# Altium schematic sheet ae302f.SchDoc
size C
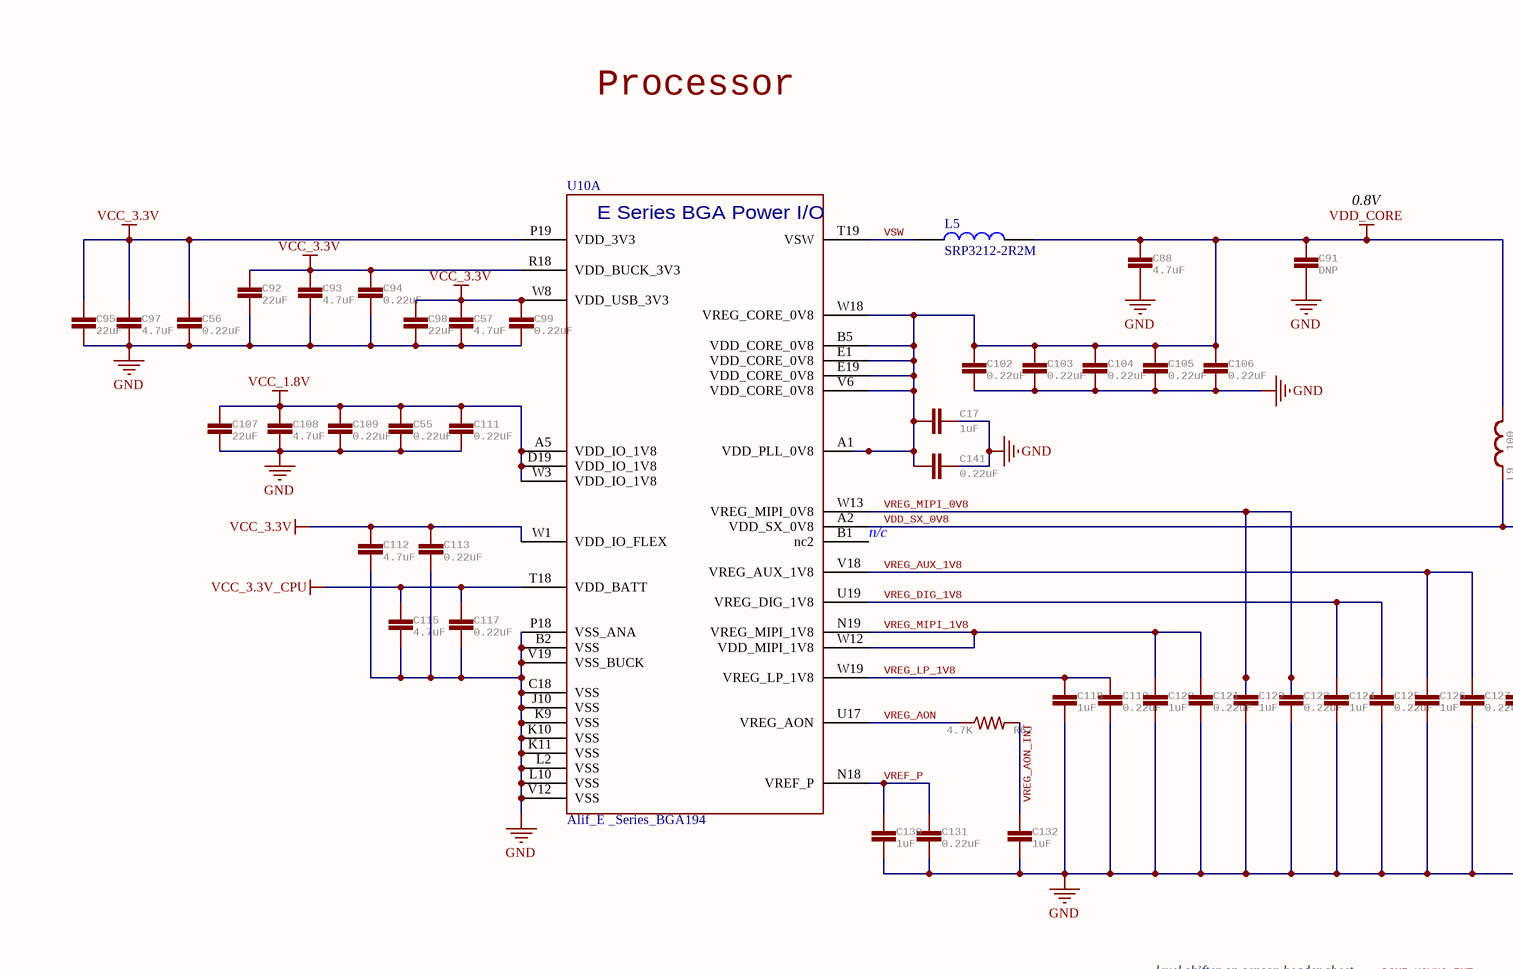
[diagram p0: ae302f.SchDoc, top left]
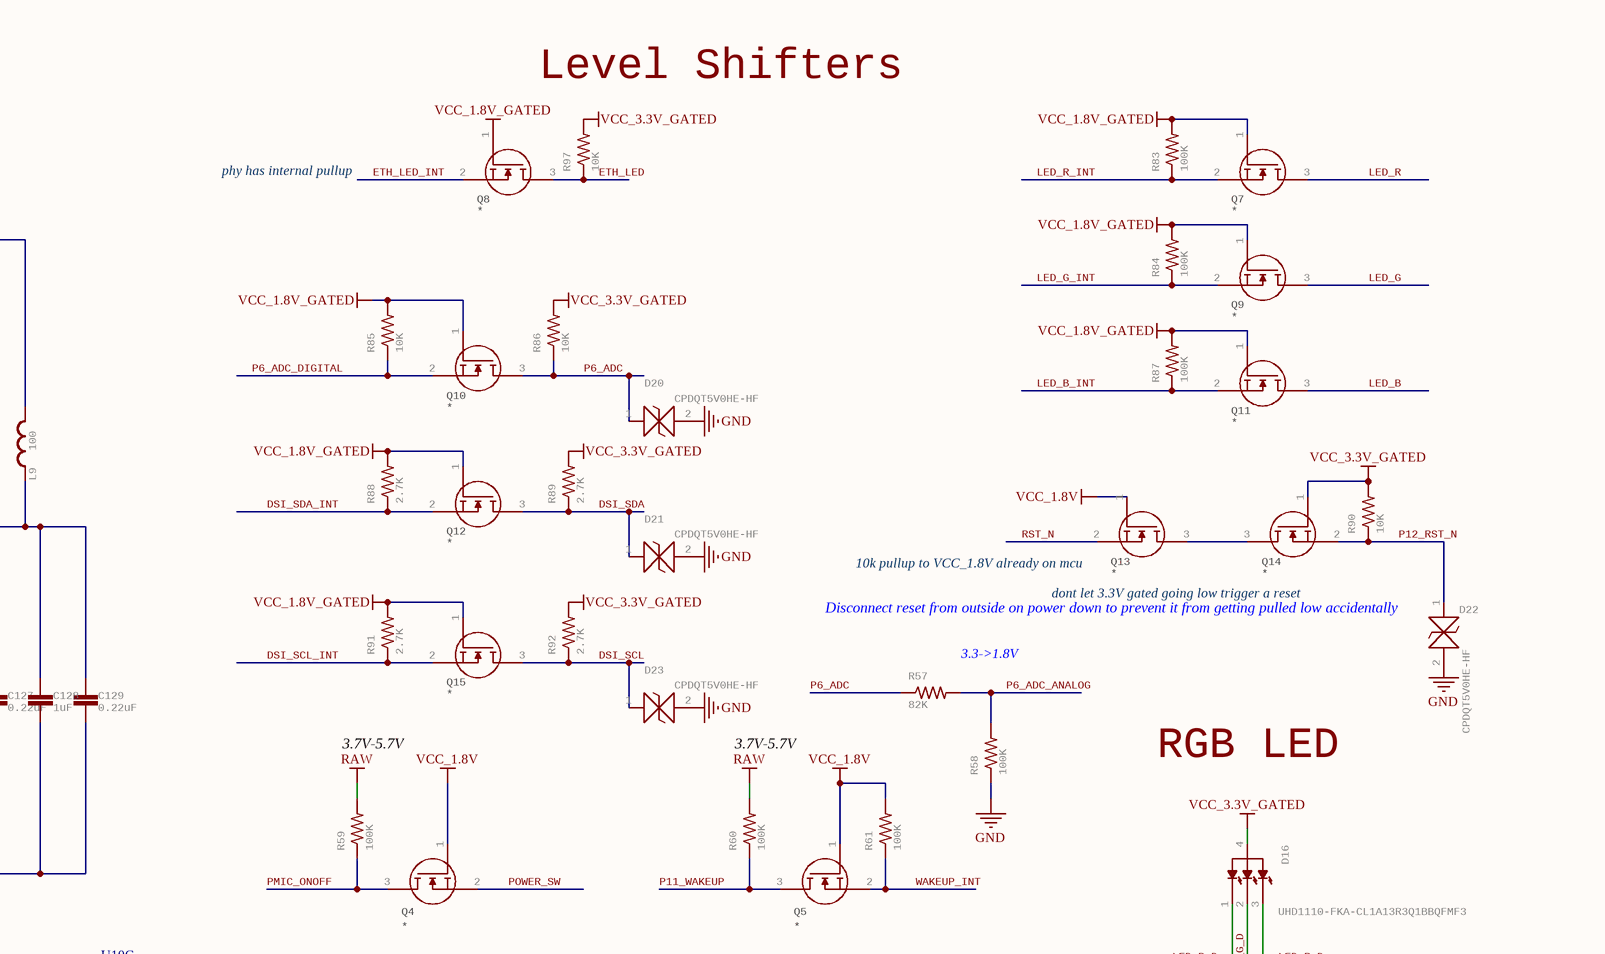
[diagram p1: ae302f.SchDoc, top right]
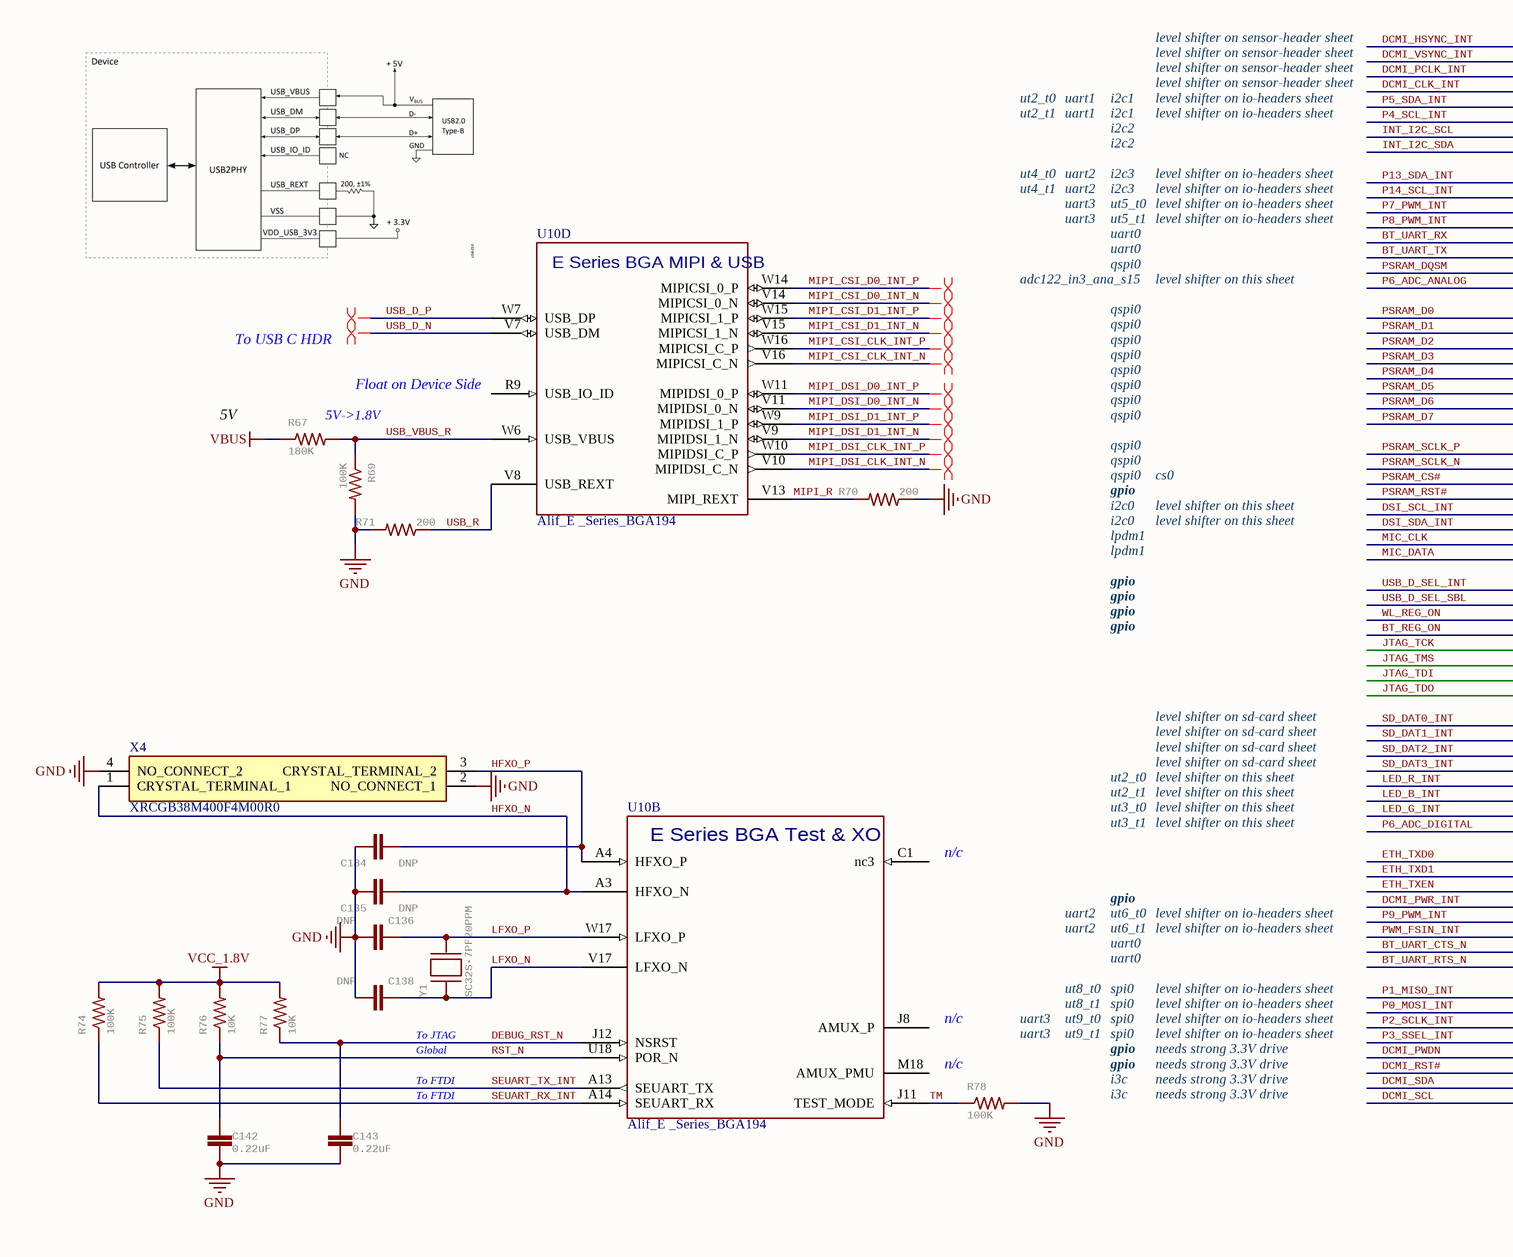
[diagram p2: ae302f.SchDoc, bottom left]
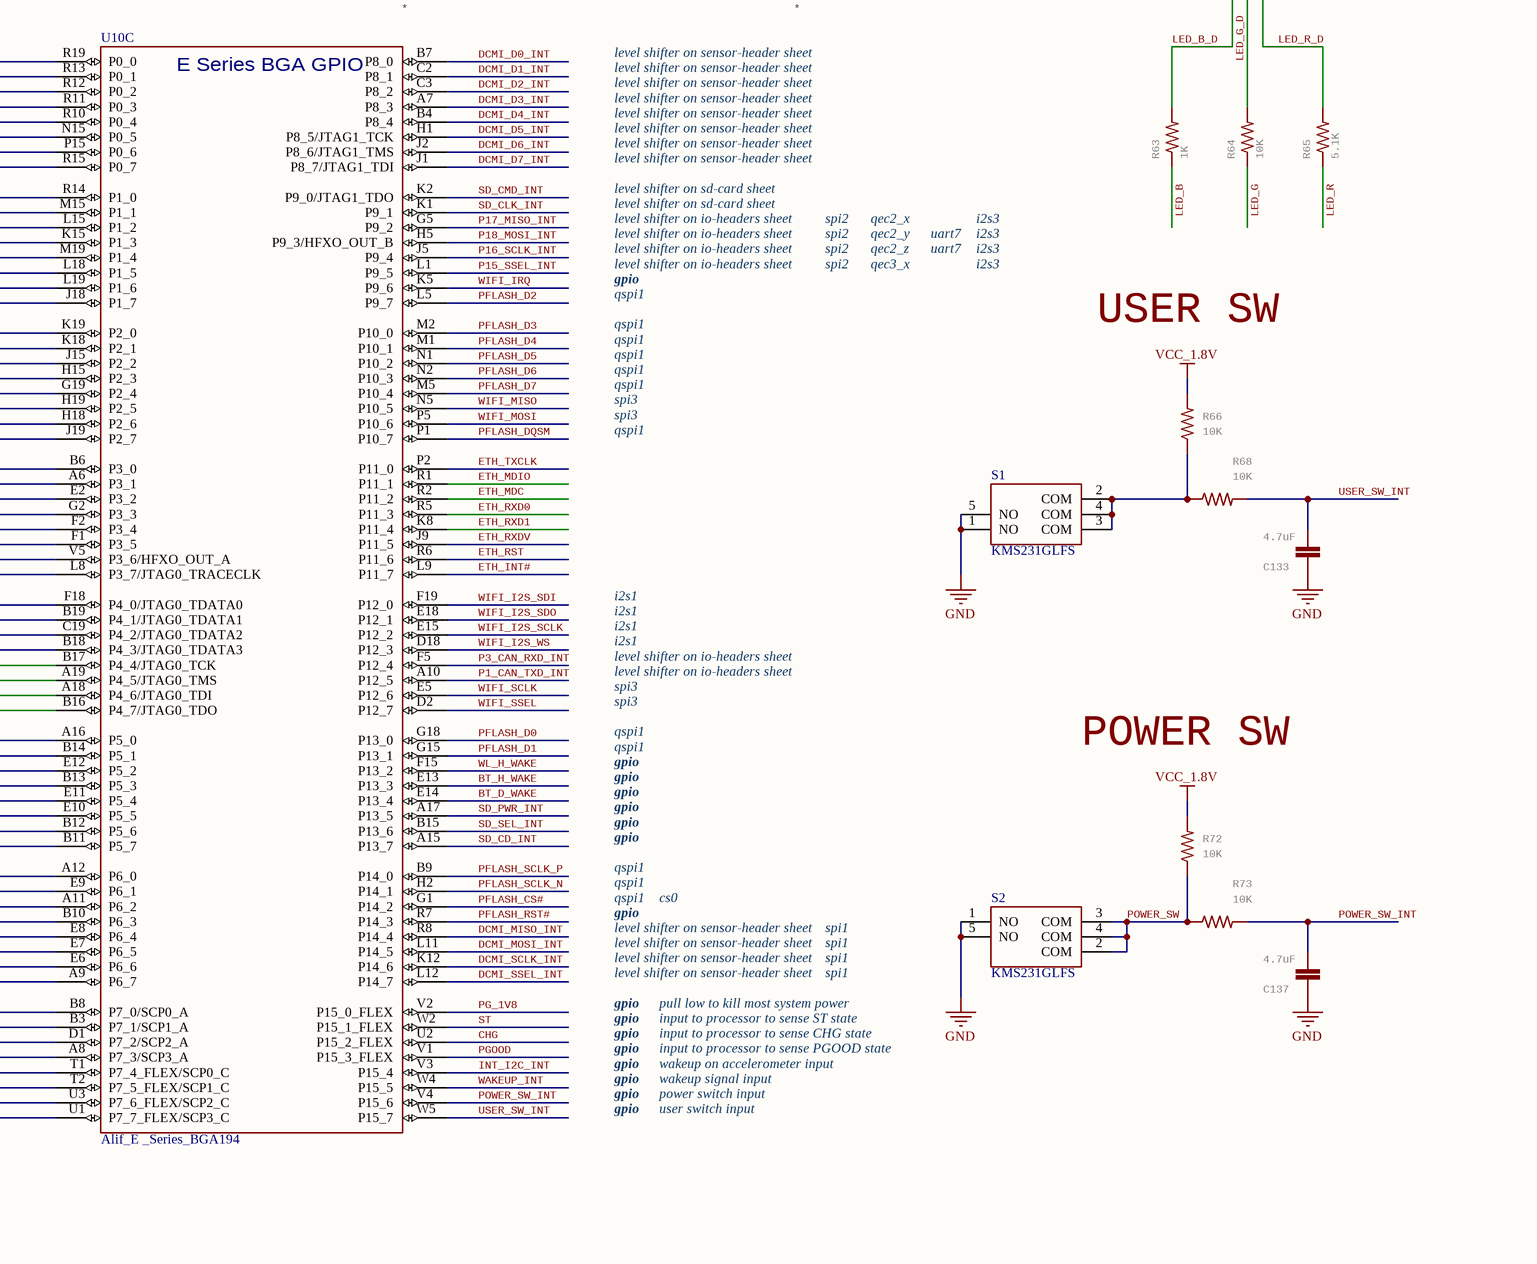
[diagram p3: ae302f.SchDoc, bottom right]

## Parts
C17  1uF  [0402-CAP]
C55  0.22uF  [C0201]
C56  0.22uF  [C0201]
C57  4.7uF  [0402-CAP]
C88  4.7uF  [0402-CAP]
C91  DNP  [0805]
C92  22uF  [0805]
C93  4.7uF  [0402-CAP]
C94  0.22uF  [C0201]
C95  22uF  [0805]
C97  4.7uF  [0402-CAP]
C98  22uF  [0805]
C99  0.22uF  [C0201]
C102  0.22uF  [C0201]
C103  0.22uF  [C0201]
C104  0.22uF  [C0201]
C105  0.22uF  [C0201]
C106  0.22uF  [C0201]
C107  22uF  [0805]
C108  4.7uF  [0402-CAP]
C109  0.22uF  [C0201]
C111  0.22uF  [C0201]
C112  4.7uF  [0402-CAP]
C113  0.22uF  [C0201]
C115  4.7uF  [0402-CAP]
C117  0.22uF  [C0201]
C118  1uF  [0402-CAP]
C119  0.22uF  [C0201]
C120  1uF  [0402-CAP]
C121  0.22uF  [C0201]
C122  1uF  [0402-CAP]
C123  0.22uF  [C0201]
C124  1uF  [0402-CAP]
C125  0.22uF  [C0201]
C126  1uF  [0402-CAP]
C127  0.22uF  [C0201]
C128  1uF  [0402-CAP]
C129  0.22uF  [C0201]
C130  1uF  [0402-CAP]
C131  0.22uF  [C0201]
C132  1uF  [0402-CAP]
C133  4.7uF  [0402-CAP]
C134  DNP  [C0201]
C135  DNP  [C0201]
C136  DNP  [C0201]
C137  4.7uF  [0402-CAP]
C138  DNP  [C0201]
C141  0.22uF  [C0201]
C142  0.22uF  [C0201]
C143  0.22uF  [C0201]
D16  UHD1110-FKA-CL1A13R3Q1BBQFMF3  [LED_UHD1110-FKA-CL1A13R3Q1BBQFMF3]
D20  CPDQT5V0HE-HF  [CPDQT5V0HEHF]
D21  CPDQT5V0HE-HF  [CPDQT5V0HEHF]
D22  CPDQT5V0HE-HF  [CPDQT5V0HEHF]
D23  CPDQT5V0HE-HF  [CPDQT5V0HEHF]
L5  SRP3212-2R2M  [IND3225X100N]
L9  100  [C0402]
Q4  NMOS  [DFN1006]  (value not drawn)
Q5  NMOS  [DFN1006]  (value not drawn)
Q7  NMOS  [DFN1006]  (value not drawn)
Q8  NMOS  [DFN1006]  (value not drawn)
Q9  NMOS  [DFN1006]  (value not drawn)
Q10  NMOS  [DFN1006]  (value not drawn)
Q11  NMOS  [DFN1006]  (value not drawn)
Q12  NMOS  [DFN1006]  (value not drawn)
Q13  NMOS  [DFN1006]  (value not drawn)
Q14  NMOS  [DFN1006]  (value not drawn)
Q15  NMOS  [DFN1006]  (value not drawn)
R57  82K  [R0201]
R58  100K  [R0201]
R59  100K  [0402-RES]
R60  100K  [R0201]
R61  100K  [R0201]
R62  4.7K  [0402-RES]
R63  1K  [R0201]
R64  10K  [R0201]
R65  5.1K  [R0201]
R66  10K  [0402-RES]
R67  180K  [R0201]
R68  10K  [0402-RES]
R69  100K  [R0201]
R70  200  [R0201]
R71  200  [R0201]
R72  10K  [0402-RES]
R73  10K  [0402-RES]
R74  100K  [R0201]
R75  100K  [R0201]
R76  10K  [R0201]
R77  10K  [R0201]
R78  100K  [r0201]
R83  100K  [R0201]
R84  100K  [R0201]
R85  10K  [R0201]
R86  10K  [R0201]
R87  100K  [R0201]
R88  2.7K  [R0201]
R89  2.7K  [R0201]
R90  10K  [R0201]
R91  2.7K  [R0201]
R92  2.7K  [R0201]
R97  10K  [R0201]
S1  KMS231GLFS  [KMS231GLFS]
S2  KMS231GLFS  [KMS231GLFS]
U10  Alif_E _Series_BGA194  [BGA194 _CENTERED]  (parts A,B,C,D of 4)
X4  XRCGB38M400F4M00R0  [XTAL_2016]
Y1  SC32S-7PF20PPM  [XTAL_ABS07-32.768KHZ-7-T]

## Nets
GND: C17.2 C55.1 C56.1 C57.2 C88.2 C91.1 C92.1 C93.2 C94.1 C95.1 C97.2 C98.1 C99.1 C102.1 C103.1 C104.1 C105.1 C106.1 C107.1 C108.2 C109.1 C111.1 C112.2 C113.1 C115.2 C117.1 C118.2 C119.1 C120.2 C121.1 C122.2 C123.1 C124.2 C125.1 C126.2 C127.2 C128.2 C129.1 C130.2 C131.1 C132.2 C133.1 C134.1 C135.1 C136.2 C137.1 C138.2 C141.1 C142.1 C143.1 D20.2 D21.2 D22.2 D23.2 R58.1 R69.2 R70.1 R71.2 R78.2 S1.1(NO) S1.5(NO) S2.1(NO) S2.5(NO) U10.B2(VSS) U10.C18(VSS) U10.J10(VSS) U10.K9(VSS) U10.K10(VSS) U10.K11(VSS) U10.L2(VSS) U10.L10(VSS) U10.P18(VSS_ANA) U10.V12(VSS) U10.V19(VSS_BUCK) X4.2(NO_CONNECT_1) X4.4(NO_CONNECT_2)
RAW: R59.2 R60.2
VBUS: R67.1
VCC_1.8V: C55.2 C107.2 C108.1 C109.2 C111.2 Q4.1(G) Q5.1(G) Q13.1(G) R61.2 R66.2 R72.2 R74.2 R75.2 R76.2 R77.2 U10.A5(VDD_IO_1V8) U10.D19(VDD_IO_1V8) U10.W3(VDD_IO_1V8)
VCC_1.8V_GATED: Q7.1(G) Q8.1(G) Q9.1(G) Q10.1(G) Q11.1(G) Q12.1(G) Q15.1(G) R83.2 R84.2 R85.2 R87.2 R88.2 R91.2
VCC_3.3V: C56.2 C57.1 C92.2 C93.1 C94.2 C95.2 C97.1 C98.2 C99.2 C112.1 C113.2 U10.P19(VDD_3V3) U10.R18(VDD_BUCK_3V3) U10.W1(VDD_IO_FLEX) U10.W8(VDD_USB_3V3)
VCC_3.3V_CPU: C115.1 C117.2 U10.T18(VDD_BATT)
VCC_3.3V_GATED: D16.4(ANODE) Q14.1(G) R86.2 R89.2 R90.2 R92.2 R97.2
VDD_CORE: C17.1 C88.1 C91.2 C102.2 C103.2 C104.2 C105.2 C106.2 C141.2 L5.2 L9.2 U10.A1(VDD_PLL_0V8) U10.B5(VDD_CORE_0V8) U10.E1(VDD_CORE_0V8) U10.E19(VDD_CORE_0V8) U10.V6(VDD_CORE_0V8) U10.W18(VREG_CORE_0V8)
BT_D_WAKE: U10.E14(P13_4)
BT_H_WAKE: U10.E13(P13_3)
BT_REG_ON: U10.B18(P4_3/JTAG0_TDATA3)
BT_UART_CTS_N: U10.E6(P6_6)
BT_UART_RTS_N: U10.A9(P6_7)
BT_UART_RX: U10.M19(P1_4)
BT_UART_TX: U10.L18(P1_5)
CHG: U10.U2(P15_2_FLEX)
DCMI_CLK_INT: U10.R11(P0_3)
DCMI_D0_INT: U10.B7(P8_0)
DCMI_D1_INT: U10.C2(P8_1)
DCMI_D2_INT: U10.C3(P8_2)
DCMI_D3_INT: U10.A7(P8_3)
DCMI_D4_INT: U10.B4(P8_4)
DCMI_D5_INT: U10.H1(P8_5/JTAG1_TCK)
DCMI_D6_INT: U10.J2(P8_6/JTAG1_TMS)
DCMI_D7_INT: U10.J1(P8_7/JTAG1_TDI)
DCMI_HSYNC_INT: U10.R19(P0_0)
DCMI_MISO_INT: U10.R8(P14_4)
DCMI_MOSI_INT: U10.L11(P14_5)
DCMI_PCLK_INT: U10.R12(P0_2)
DCMI_PWDN: U10.T1(P7_4_FLEX/SCP0_C)
DCMI_PWR_INT: U10.B10(P6_3)
DCMI_RST#: U10.T2(P7_5_FLEX/SCP1_C)
DCMI_SCL: U10.U1(P7_7_FLEX/SCP3_C)
DCMI_SCLK_INT: U10.K12(P14_6)
DCMI_SDA: U10.U3(P7_6_FLEX/SCP2_C)
DCMI_SSEL_INT: U10.L12(P14_7)
DCMI_VSYNC_INT: U10.R13(P0_1)
DEBUG_RST_N: C143.2 R77.1 U10.J12(NSRST)
DSI_SCL: D23.1 Q15.3(D) R92.1
DSI_SCL_INT: Q15.2(S) R91.1 U10.F2(P3_4)
DSI_SDA: D21.1 Q12.3(D) R89.1
DSI_SDA_INT: Q12.2(S) R88.1 U10.F1(P3_5)
ETH_INT#: U10.L9(P11_7)
ETH_LED: Q8.3(D) R97.1
ETH_LED_INT: Q8.2(S)
ETH_MDC: U10.R2(P11_2)
ETH_MDIO: U10.R1(P11_1)
ETH_RST: U10.R6(P11_6)
ETH_RXD0: U10.R5(P11_3)
ETH_RXD1: U10.K8(P11_4)
ETH_RXDV: U10.J9(P11_5)
ETH_TXCLK: U10.P2(P11_0)
ETH_TXD0: U10.A12(P6_0)
ETH_TXD1: U10.E9(P6_1)
ETH_TXEN: U10.A11(P6_2)
HFXO_N: C135.2 U10.A3(HFXO_N) X4.1(CRYSTAL_TERMINAL_1)
HFXO_P: C134.2 U10.A4(HFXO_P) X4.3(CRYSTAL_TERMINAL_2)
INT_I2C_INT: U10.V3(P15_4)
INT_I2C_SCL: U10.P15(P0_6)
INT_I2C_SDA: U10.R15(P0_7)
JTAG_TCK: U10.B17(P4_4/JTAG0_TCK)
JTAG_TDI: U10.A18(P4_6/JTAG0_TDI)
JTAG_TDO: U10.B16(P4_7/JTAG0_TDO)
JTAG_TMS: U10.A19(P4_5/JTAG0_TMS)
LED_B: Q11.3(D) R63.1
LED_B_D: D16.1(BLUE) R63.2
LED_B_INT: Q11.2(S) R87.1 U10.E10(P5_5)
LED_G: Q9.3(D) R64.1
LED_G_D: D16.2(GREEN) R64.2
LED_G_INT: Q9.2(S) R84.1 U10.B12(P5_6)
LED_R: Q7.3(D) R65.1
LED_R_D: D16.3(RED) R65.2
LED_R_INT: Q7.2(S) R83.1 U10.E11(P5_4)
LFXO_N: C138.1 U10.V17(LFXO_N) Y1.1
LFXO_P: C136.1 U10.W17(LFXO_P) Y1.2
MIC_CLK: U10.V5(P3_6/HFXO_OUT_A)
MIC_DATA: U10.L8(P3_7/JTAG0_TRACECLK)
MIPI_CSI_CLK_INT_N: U10.V16(MIPICSI_C_N)
MIPI_CSI_CLK_INT_P: U10.W16(MIPICSI_C_P)
MIPI_CSI_D0_INT_N: U10.V14(MIPICSI_0_N)
MIPI_CSI_D0_INT_P: U10.W14(MIPICSI_0_P)
MIPI_CSI_D1_INT_N: U10.V15(MIPICSI_1_N)
MIPI_CSI_D1_INT_P: U10.W15(MIPICSI_1_P)
MIPI_DSI_CLK_INT_N: U10.V10(MIPIDSI_C_N)
MIPI_DSI_CLK_INT_P: U10.W10(MIPIDSI_C_P)
MIPI_DSI_D0_INT_N: U10.V11(MIPIDSI_0_N)
MIPI_DSI_D0_INT_P: U10.W11(MIPIDSI_0_P)
MIPI_DSI_D1_INT_N: U10.V9(MIPIDSI_1_N)
MIPI_DSI_D1_INT_P: U10.W9(MIPIDSI_1_P)
MIPI_R: R70.2 U10.V13(MIPI_REXT)
P0_MOSI_INT: U10.B3(P7_1/SCP1_A)
P1_CAN_TXD_INT: U10.A10(P12_5)
P1_MISO_INT: U10.B8(P7_0/SCP0_A)
P2_SCLK_INT: U10.D1(P7_2/SCP2_A)
P3_CAN_RXD_INT: U10.F5(P12_4)
P3_SSEL_INT: U10.A8(P7_3/SCP3_A)
P4_SCL_INT: U10.N15(P0_5)
P5_SDA_INT: U10.R10(P0_4)
P6_ADC: D20.1 Q10.3(D) R57.1 R86.1
P6_ADC_ANALOG: R57.2 R58.2 U10.J18(P1_7)
P6_ADC_DIGITAL: Q10.2(S) R85.1 U10.B11(P5_7)
P7_PWM_INT: U10.L15(P1_2)
P8_PWM_INT: U10.K15(P1_3)
P9_PWM_INT: U10.E8(P6_4)
P11_WAKEUP: Q5.3(D) R60.1
P12_RST_N: D22.1 Q14.2(S) R90.1
P13_SDA_INT: U10.R14(P1_0)
P14_SCL_INT: U10.M15(P1_1)
P15_SSEL_INT: U10.L1(P9_5)
P16_SCLK_INT: U10.J5(P9_4)
P17_MISO_INT: U10.G5(P9_2)
P18_MOSI_INT: U10.H5(P9_3/HFXO_OUT_B)
PFLASH_CS#: U10.G1(P14_2)
PFLASH_D0: U10.G18(P13_0)
PFLASH_D1: U10.G15(P13_1)
PFLASH_D2: U10.L5(P9_7)
PFLASH_D3: U10.M2(P10_0)
PFLASH_D4: U10.M1(P10_1)
PFLASH_D5: U10.N1(P10_2)
PFLASH_D6: U10.N2(P10_3)
PFLASH_D7: U10.M5(P10_4)
PFLASH_DQSM: U10.P1(P10_7)
PFLASH_RST#: U10.R7(P14_3)
PFLASH_SCLK_N: U10.H2(P14_1)
PFLASH_SCLK_P: U10.B9(P14_0)
PG_1V8: U10.V2(P15_0_FLEX)
PGOOD: U10.V1(P15_3_FLEX)
PMIC_ONOFF: Q4.3(D) R59.1
POWER_SW: Q4.2(S) R72.1 R73.1 S2.2(COM) S2.3(COM) S2.4(COM)
POWER_SW_INT: C137.2 R73.2 U10.V4(P15_6)
PSRAM_CS#: U10.E2(P3_2)
PSRAM_D0: U10.K19(P2_0)
PSRAM_D1: U10.K18(P2_1)
PSRAM_D2: U10.J15(P2_2)
PSRAM_D3: U10.H15(P2_3)
PSRAM_D4: U10.G19(P2_4)
PSRAM_D5: U10.H19(P2_5)
PSRAM_D6: U10.H18(P2_6)
PSRAM_D7: U10.J19(P2_7)
PSRAM_DQSM: U10.L19(P1_6)
PSRAM_RST#: U10.G2(P3_3)
PSRAM_SCLK_N: U10.A6(P3_1)
PSRAM_SCLK_P: U10.B6(P3_0)
PWM_FSIN_INT: U10.E7(P6_5)
RST_N: C142.2 Q13.2(S) R76.1 U10.U18(POR_N)
SD_CD_INT: U10.A15(P13_7)
SD_CLK_INT: U10.K1(P9_1)
SD_CMD_INT: U10.K2(P9_0/JTAG1_TDO)
SD_DAT0_INT: U10.A16(P5_0)
SD_DAT1_INT: U10.B14(P5_1)
SD_DAT2_INT: U10.E12(P5_2)
SD_DAT3_INT: U10.B13(P5_3)
SD_PWR_INT: U10.A17(P13_5)
SD_SEL_INT: U10.B15(P13_6)
SEUART_RX_INT: R74.1 U10.A14(SEUART_RX)
SEUART_TX_INT: R75.1 U10.A13(SEUART_TX)
ST: U10.W2(P15_1_FLEX)
TM: R78.1 U10.J11(TEST_MODE)
USB_D_N: U10.V7(USB_DM)
USB_D_P: U10.W7(USB_DP)
USB_D_SEL_INT: U10.F18(P4_0/JTAG0_TDATA0)
USB_D_SEL_SBL: U10.B19(P4_1/JTAG0_TDATA1)
USB_R: R71.1 U10.V8(USB_REXT)
USB_VBUS_R: R67.2 R69.1 U10.W6(USB_VBUS)
USER_SW_INT: C133.2 R68.2 U10.W5(P15_7)
VDD_SX_0V8: C128.1 C129.2 L9.1 U10.A2(VDD_SX_0V8)
VREF_P: C130.1 C131.2 U10.N18(VREF_P)
VREG_AON: R62.1 U10.U17(VREG_AON)
VREG_AON_INT: C132.1 R62.2
VREG_AUX_1V8: C126.1 C127.1 U10.V18(VREG_AUX_1V8)
VREG_DIG_1V8: C124.1 C125.2 U10.U19(VREG_DIG_1V8)
VREG_LP_1V8: C118.1 C119.2 U10.W19(VREG_LP_1V8)
VREG_MIPI_0V8: C122.1 C123.2 U10.W13(VREG_MIPI_0V8)
VREG_MIPI_1V8: C120.1 C121.2 U10.N19(VREG_MIPI_1V8) U10.W12(VDD_MIPI_1V8)
VSW: L5.1 U10.T19(VSW)
WAKEUP_INT: Q5.2(S) R61.1 U10.W4(P15_5)
WIFI_I2S_SCLK: U10.E15(P12_2)
WIFI_I2S_SDI: U10.F19(P12_0)
WIFI_I2S_SDO: U10.E18(P12_1)
WIFI_I2S_WS: U10.D18(P12_3)
WIFI_IRQ: U10.K5(P9_6)
WIFI_MISO: U10.N5(P10_5)
WIFI_MOSI: U10.P5(P10_6)
WIFI_SCLK: U10.E5(P12_6)
WIFI_SSEL: U10.D2(P12_7)
WL_H_WAKE: U10.F15(P13_2)
WL_REG_ON: U10.C19(P4_2/JTAG0_TDATA2)
NetQ13_3: Q13.3(D) Q14.3(D)
NetR66_1: R66.1 R68.1 S1.2(COM) S1.3(COM) S1.4(COM)

Not connected (* = marked no-connect by the designer): U10 B1(nc2) C1(nc3) J8(AMUX_P) M18(AMUX_PMU) R9(USB_IO_ID)

## Layout directives
differential pair; differential pair class MIPI: MIPI_CSI_CLK_INT_N, MIPI_CSI_CLK_INT_P, MIPI_CSI_D0_INT_N, MIPI_CSI_D0_INT_P, MIPI_CSI_D1_INT_N, MIPI_CSI_D1_INT_P, MIPI_DSI_CLK_INT_N, MIPI_DSI_CLK_INT_P, MIPI_DSI_D0_INT_N, MIPI_DSI_D0_INT_P, MIPI_DSI_D1_INT_N, MIPI_DSI_D1_INT_P, USB_D_N, USB_D_P

## Notes on the sheet
- Processor
- Level Shifters
- 0.8V
- phy has internal pullup
- n/c
- (near Q13) 10k pullup to VCC_1.8V already on mcu
- dont let 3.3V gated going low trigger a reset
- (near D22) Disconnect reset from outside on power down to prevent it from getting pulled low accidentally
- (near R57) 3.3->1.8V
- 3.7V-5.7V
- RGB LED
- level shifter on sensor-header sheet
- ut2_t0
- ut2_t1
- uart1
- i2c1
- level shifter on io-headers sheet
- ut4_t0
- ut4_t1
- uart2
- i2c2
- i2c3
- level shifter on sd-card sheet
- uart3
- uart0
- ut5_t1
- ut5_t0
- qspi0
- gpio
- spi2
- qec2_x
- qec2_y
- qec2_z
- qec3_x
- uart7
- i2s3
- To USB C HDR
- adc122_in3_ana_s15
- level shifter on this sheet
- qspi1
- USER SW
- 5V
- (near R67) 5V->1.8V
- (near U10) Float on Device Side
- spi3
- cs0
- i2c0
- lpdm1
- i2s1
- POWER SW
- ut3_t0
- ut3_t1
- ut6_t0
- ut6_t1
- spi1
- ut8_t0
- ut8_t1
- ut9_t0
- spi0
- input to processor to sense ST state
- input to processor to sense CHG state
- pull low to kill most system power
- To JTAG
- To FTDI
- Global
- (near R78) n/c
- ut9_t1
- i3c
- needs strong 3.3V drive
- input to processor to sense PGOOD state
- power switch input
- user switch input
- wakeup signal input
- wakeup on accelerometer input
- (in symbol E7_Bx_BGA_194_noGNSS, part A) E Series BGA Power I/O
- (in symbol E7_Bx_BGA_194_noGNSS, part B) E Series BGA Test & XO
- (in symbol E7_Bx_BGA_194_noGNSS, part C) E Series BGA GPIO
- (in symbol E7_Bx_BGA_194_noGNSS, part D) E Series BGA MIPI & USB

## Library data of the parts
C17 C118 C120 C122 C124 C126 C128 C130 C132 = CAP0402-CAP: CapacitorStandard 0402 ceramic capacitor, and 0.1" leaded capacitor.; MPN: GRM155R61E105KA12J; GateName_1: G$1; SymbolName_1: CAP; DeviceName: 0402-CAP; LibraryName: sfe; DeviceSetName: CAP; Part Number: GRM155R61E105KA12J
C55 C56 C94 C99 C102-C106 C109 C111 C113 C117 C119 C121 C123 C125 C127 C129 C131 C141-C143 = C-EUC0201: CAPACITOR, European symbol; MPN: GRM033R60J224ME15D; GateName_1: G$1; SymbolName_1: C-EU; POPULARITY: 0; DeviceName: C0201; LibraryName: rcl; DeviceSetName: C-EU; SPICEPREFIX: C; Part Number: GRM033R60J224ME15D
C57 C88 C93 C97 C108 C112 C115 C133 C137 = CAP0402-CAP: CapacitorStandard 0603 ceramic capacitor, and 0.1" leaded capacitor.; MPN: JMK105BBJ475MV-F; GateName_1: G$1; SymbolName_1: CAP; DeviceName: 0402-CAP; LibraryName: sfe; DeviceSetName: CAP; Part Number: JMK105BBJ475MV-F
C91 = 22UF-0805-6.3V-20%: 22ÂµF ceramic capacitors    A capacitor is a passive two-terminal electrical component used to store electrical energy temporarily in an electric field.; GateName_1: G$1; SymbolName_1: CAP; DeviceSetName: 22UF; PROD_ID: CAP-08402; DeviceName: -0805-6.3V-20%; LibraryName: SparkFun-Capacitors; MPN: DNP; Part Number: DNP
C92 C95 C98 C107 = 22UF-0805-6.3V-20%: 22ÂµF ceramic capacitors    A capacitor is a passive two-terminal electrical component used to store electrical energy temporarily in an electric field.; MPN: CL21A226MQQNNNE; GateName_1: G$1; SymbolName_1: CAP; PROD_ID: CAP-08402; DeviceName: -0805-6.3V-20%; LibraryName: SparkFun-Capacitors; DeviceSetName: 22UF; Part Number: CL21A226MQQNNNE
C134-C136 C138 = C-EUC0201: CAPACITOR, European symbol; GateName_1: G$1; SymbolName_1: C-EU; POPULARITY: 0; DeviceName: C0201; LibraryName: rcl; DeviceSetName: C-EU; MPN: DNP; SPICEPREFIX: C; Part Number: DNP
D16 = UHD1110-FKA-CL1A13R3Q1BBQFMF3: LED RGB SMD, SIZE 1 X 1 mm Check availability; GateName_1: G$1; MF: Cree Inc.; SymbolName_1: UHD1110-FKA-CL1A13R3Q1BBQFMF3; LibraryName: UHD1110-FKA-CL1A13R3Q1BBQFMF3; DeviceSetName: UHD1110-FKA-CL1A13R3Q1BBQFMF3; AVAILABILITY: In Stock; MP: UHD1110-FKA-CL1A13R3Q1BBQFMF3; MPN: UHD1110-FKA-CL1A13r3q1BBQFMF3; PACKAGE: 0404 Cree Inc.; PRICE: None; PURCHASE-URL: https://pricing.snapeda.com/search/part/UHD1110-FKA-CL1A13R3Q1BBQFMF3/?ref=eda; Part Number: UHD1110-FKA-CL1A13r3q1BBQFMF3
D20-D23 = CPDQT5V0HE-HF: ESD Suppressors / TVS Diodes DIODE ESD 5VWM 65W 0402/SOD-923F   Source:  Datasheet; MANUFACTURER_NAME: Comchip Technology; GateName_1: G$1; SymbolName_1: CPDQT5V0HE-HF; LibraryName: CPDQT5V0HE-HF; DeviceSetName: CPDQT5V0HE-HF; HEIGHT: 0.42mm; MANUFACTURER_PART_NUMBER: CPDQT5V0HE-HF; MOUSER_PART_NUMBER: MOUSER_PART_NUMBER; MOUSER_PRICE-STOCK: MOUSER_PRICE-STOCK; MPN: CPDQT5V0HE-HF; Part Number: CPDQT5V0HE-HF
L5 = SRP3212-2R2M: Ind,3.2x2.5x1mm,2.2uH?20%,4A,shd; Manufacturer_Name: Bourns; Geometry.Height: 1mm; Mouser Part Number: 652-SRP3212-2R2M; Mouser Price/Stock: https://www.mouser.co.uk/ProductDetail/Bourns/SRP3212-2R2M?qs=t7xnP681wgW9NT%2FfJNx1CA%3D%3D; Manufacturer_Part_Number: SRP3212-2R2M; Datasheet Link: https://www.bourns.com/pdfs/CVH.pdf; Part Number: SRP3212-2R2M; MPN: SRP3212-2R2M
L9 = INDUCTOR0402: InductorsBasic Inductor/Choke - 0603 and 1206. Footprints are not proven and vary greatly between part numbers.; MPN: MFBM1V1005-101-R; GateName_1: G$1; DeviceName: 0402; SymbolName_1: INDUCTOR; LibraryName: sfe; DeviceSetName: INDUCTOR; Part Number: MFBM1V1005-101-R
R57 R58 R60 R61 R67 R69-R71 R74-R78 R83 R84 R87-R89 R91 R92 = RESISTOR0402-RES: GateName_1: G$1; SymbolName_1: RESISTOR; LibraryName: sfe; DeviceSetName: RESISTOR
R59 = RESISTOR0402-RES: ResistorBasic schematic elements and footprints for 0603, 1206, and PTH resistors.; MPN: AC0402FR-07100KL; GateName_1: G$1; SymbolName_1: RESISTOR; DeviceName: 0402-RES; LibraryName: sfe; DeviceSetName: RESISTOR; Part Number: AC0402FR-07100KL
R62 = RESISTOR0402-RES: ResistorBasic schematic elements and footprints for 0603, 1206, and PTH resistors.; MPN: RT0402FRE074K7L; GateName_1: G$1; SymbolName_1: RESISTOR; DeviceName: 0402-RES; LibraryName: sfe; DeviceSetName: RESISTOR; Part Number: RT0402FRE074K7L
R63-R65 R85 R86 R90 R97 = RESISTOR0402-RES: ResistorBasic schematic elements and footprints for 0603, 1206, and PTH resistors.; GateName_1: G$1; SymbolName_1: RESISTOR; LibraryName: sfe; DeviceSetName: RESISTOR
R66 R68 R72 R73 = RESISTOR0402-RES: ResistorBasic schematic elements and footprints for 0603, 1206, and PTH resistors.; MPN: AC0402FR-1310K; GateName_1: G$1; SymbolName_1: RESISTOR; DeviceName: 0402-RES; LibraryName: sfe; DeviceSetName: RESISTOR; Part Number: AC0402FR-1310K
U10 = E7_Bx_BGA_194_noGNSS: IC,Alif E7 MCU, Rev B silicon,BGA194; Manufacturer 1: Alif Semi; Manufacturer Part Number 1: AE302F80F55D5LE; Part Number: AE302F80F55D5LE; MPN: AE302F80F55D5LE
X4 = XRCGB38M400F4M00R0: 2.0X1.6X0.65MM 38.4MHZ CRYSTAL; Manufacturer_Name: Murata Electronics; Geometry.Height: 0.7mm; Mouser Part Number: *; Mouser Price/Stock: *; Manufacturer_Part_Number: XRCGB38M400F4M00R0; Datasheet Link: http://www.murata.com/products/productdata/8801066811422/SPEC-XRCGB38M400F4M00R0.pdf; Part Number: XRCGB38M400F4M00R0; MPN: XRCGB38M400F4M00R0
Y1 = ABS07-32.768KHZ-7-T: Check availability; GateName_1: G$1; MF: Abracon; SymbolName_1: ABS07-32.768KHZ-7-T; LibraryName: ABS07-32.768KHZ-7-T; DeviceSetName: ABS07-32.768KHZ-7-T; AVAILABILITY: In Stock; MP: ABS07-32.768KHZ-7-T; MPN: SC32S-7PF20PPM; PACKAGE: SMD-2 Abracon LLC; PRICE: None; PURCHASE-URL: https://pricing.snapeda.com/search/part/ABS07-32.768KHZ-7-T/?ref=eda; Part Number: SC32S-7PF20PPM
Q4 Q5 Q7-Q15 = NMOS: MPN: *
S1 S2 = KMS231GLFS: Part Number: KMS231GLFS; MPN: KMS231GLFS